# Altium schematic sheet CAN_BUS.SchDoc
size A4; SheetNumber: 1; SheetTotal: 1
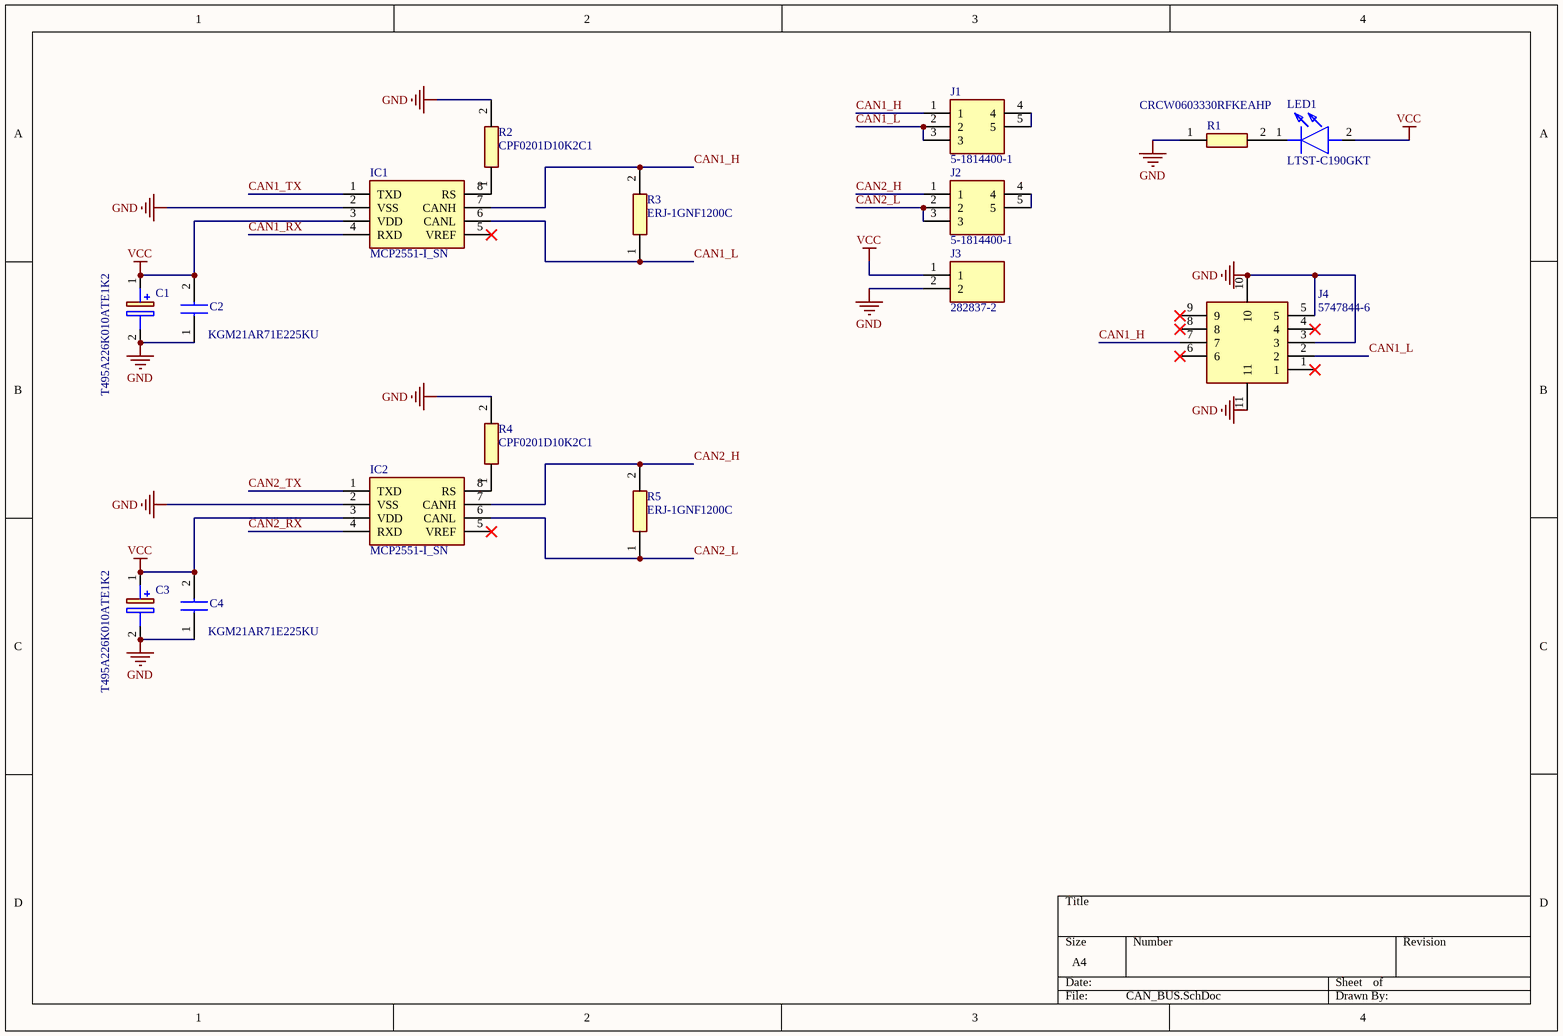
[diagram p0: CAN_BUS.SchDoc]

## Parts
C1  T495A226K010ATE1K2  [T495A]
C2  KGM21AR71E225KU  [CAPC2012X135N]
C3  T495A226K010ATE1K2  [T495A]
C4  KGM21AR71E225KU  [CAPC2012X135N]
IC1  MCP2551-I_SN  [SOIC127P600X175-8N]
IC2  MCP2551-I_SN  [SOIC127P600X175-8N]
J1  5-1814400-1  [518144001]
J2  5-1814400-1  [518144001]
J3  282837-2  [2828372]
J4  5747844-6  [57478446]
LED1  LTST-C190GKT  [LEDC1608X90N]
R1  CRCW0603330RFKEAHP  [CAPC1608X55N]
R2  CPF0201D10K2C1  [RESC0603X28N]
R3  ERJ-1GNF1200C  [ERJ1GN_(0201)]
R4  CPF0201D10K2C1  [RESC0603X28N]
R5  ERJ-1GNF1200C  [ERJ1GN_(0201)]

## Nets
GND: C1.2(-) C2.1 C3.2(-) C4.1 IC1.2(VSS) IC2.2(VSS) J3.2 J4.3 J4.5 J4.10 J4.11 R1.1 R2.2 R4.2
VCC: C1.1(+) C2.2 C3.1(+) C4.2 IC1.3(VDD) IC2.3(VDD) J3.1 LED1.2(A)
CAN1_H: IC1.7(CANH) J1.1 J4.7 R3.2
CAN1_L: IC1.6(CANL) J1.2 J1.3 J4.2 R3.1
CAN1_RX: IC1.4(RXD)
CAN1_TX: IC1.1(TXD)
CAN2_H: IC2.7(CANH) J2.1 R5.2
CAN2_L: IC2.6(CANL) J2.2 J2.3 R5.1
CAN2_RX: IC2.4(RXD)
CAN2_TX: IC2.1(TXD)
NetIC1_8: IC1.8(RS) R2.1
NetIC2_8: IC2.8(RS) R4.1
NetJ1_4: J1.4 J1.5
NetJ2_4: J2.4 J2.5
NetLED1_1: LED1.1(K) R1.2

Not connected (* = marked no-connect by the designer): IC1 5(VREF)*; IC2 5(VREF)*; J4 1* 4* 6* 8* 9*

## Library data of the parts
C1 C3 = T495A226K010ATE1K2: Capacitor Polarised; Manufacturer_Name: KEMET; Datasheet Link: https://content.kemet.com/datasheets/KEM_T2009_T495.pdf; Height: 1.8mm; Manufacturer_Part_Number: T495A226K010ATE1K2; Mouser Part Number: 80-T495A226K10ATE1K2; Mouser Price/Stock: https://www.mouser.co.uk/ProductDetail/KEMET/T495A226K010ATE1K2?qs=sSYV1F9c5cELTAm7MEUyXw%3D%3D
C2 C4 = KGM21AR71E225KU: Capacitor; Manufacturer_Name: KYOCERA; Datasheet Link: https://pt.mouser.com/ProductDetail/KYOCERA-AVX/KGM21AR71E225KU?qs=sGAEpiMZZMt7gvpyg0xT8jBHDtGZvLzXyjuUdgmQe5tN2DBxA0np4w%3D%3D; Height: 1.35mm; Manufacturer_Part_Number: KGM21AR71E225KU; Mouser Part Number: 581-KGM21AR71E225KU; Mouser Price/Stock: https://www.mouser.co.uk/ProductDetail/KYOCERA-AVX/KGM21AR71E225KU?qs=Jm2GQyTW%2FbhCn4KuUMBp1Q%3D%3D
IC1 IC2 = MCP2551-I_SN: Integrated Circuit; Manufacturer_Name: Microchip; Manufacturer_Part_Number: MCP2551-I/SN; Datasheet Link: https://datasheet.datasheetarchive.com/originals/distributors/Datasheets-34/DSA-674994.pdf; Height: 1.75mm; Mouser Part Number: 579-MCP2551-I/SN; Mouser Price/Stock: https://www.mouser.co.uk/ProductDetail/Microchip-Technology/MCP2551-I-SN?qs=9y3LFqDLL8L5zFfqqxdOHg%3D%3D; Arrow Part Number: MCP2551-I/SN; Arrow Price/Stock: https://www.arrow.com/en/products/mcp2551-isn/microchip-technology?region=nac
J1 J2 = 5-1814400-1: Connector; Manufacturer_Name: TE Connectivity; Datasheet Link: https://www.te.com/commerce/DocumentDelivery/DDEController?Action=showdoc&DocId=Customer+Drawing%7F1814400%7FD%7Fpdf%7FEnglish%7FENG_CD_1814400_D_baseFilename.pdf%7F5-1814400-1; Height: 10.43mm; Manufacturer_Part_Number: 5-1814400-1; Mouser Part Number: 571-5-1814400-1; Mouser Price/Stock: https://www.mouser.co.uk/ProductDetail/TE-Connectivity/5-1814400-1?qs=ZMVvPt2N%252B83mDSbcJPKgOA%3D%3D; Arrow Part Number: 5-1814400-1; Arrow Price/Stock: https://www.arrow.com/en/products/5-1814400-1/te-connectivity
J3 = 282837-2: Connector; Manufacturer_Name: TE Connectivity; Datasheet Link: https://www.te.com/commerce/DocumentDelivery/DDEController?Action=srchrtrv&DocNm=282837&DocType=Customer+Drawing&DocLang=English&DocFormat=pdf&PartCntxt=282837-2; Height: 10.3mm; Manufacturer_Part_Number: 282837-2; Mouser Part Number: 571-2828372; Mouser Price/Stock: https://www.mouser.co.uk/ProductDetail/TE-Connectivity/282837-2?qs=A%252Bip%252BNCYi6O2H0NGWOeAxg%3D%3D; Arrow Part Number: 282837-2; Arrow Price/Stock: https://www.arrow.com/en/products/282837-2/te-connectivity?region=europe
J4 = 5747844-6: Connector; Manufacturer_Name: TE Connectivity; Datasheet Link: http://www.te.com/commerce/DocumentDelivery/DDEController?Action=showdoc&DocId=Customer+Drawing%7F5747844%7FP%7Fpdf%7FEnglish%7FENG_CD_5747844_P.pdf%7F5747844-6; Height: 12mm; Manufacturer_Part_Number: 5747844-6; Mouser Part Number: 571-5747844-6; Mouser Price/Stock: https://www.mouser.co.uk/ProductDetail/TE-Connectivity/5747844-6?qs=x6EjVpvqMVNBaI3EeeZZVw%3D%3D; Arrow Part Number: 5747844-6; Arrow Price/Stock: https://www.arrow.com/en/products/5747844-6/te-connectivity?region=europe
LED1 = LTST-C190GKT: LED; Manufacturer_Name: Lite-On; Datasheet Link: https://media.digikey.com/pdf/Data%20Sheets/Lite-On%20PDFs/LTST-C190GKT.pdf; Height: 0.9mm; Manufacturer_Part_Number: LTST-C190GKT; Mouser Part Number: 859-LTST-C190GKT; Mouser Price/Stock: https://www.mouser.co.uk/ProductDetail/Lite-On/LTST-C190GKT?qs=drxkyCeiWgbQzclgbojDOg%3D%3D; Arrow Part Number: LTST-C190GKT; Arrow Price/Stock: https://www.arrow.com/en/products/ltst-c190gkt/lite-on-technology?region=nac
R1 = CRCW0603330RFKEAHP: Resistor; Manufacturer_Name: Vishay; Datasheet Link: http://uk.rs-online.com/web/p/products/8206830; Height: 0.55mm; Manufacturer_Part_Number: CRCW0603330RFKEAHP; Mouser Part Number: 71-CRCW0603330RFKEAH; Mouser Price/Stock: https://www.mouser.co.uk/ProductDetail/Vishay-Dale/CRCW0603330RFKEAHP?qs=40TFAHZMFve19Cb4zHLgwA%3D%3D; Arrow Part Number: CRCW0603330RFKEAHP; Arrow Price/Stock: https://www.arrow.com/en/products/crcw0603330rfkeahp/vishay?region=nac
R2 R4 = CPF0201D10K2C1: Resistor; Manufacturer_Name: TE Connectivity; Datasheet Link: http://www.te.com/commerce/DocumentDelivery/DDEController?Action=showdoc&DocId=Data+Sheet%7F1773200-1%7FA%7Fpdf%7FEnglish%7FENG_DS_1773200-1_A.pdf%7F4-2176215-6; Height: 0.28mm; Manufacturer_Part_Number: CPF0201D10K2C1; Mouser Part Number: N/A; Mouser Price/Stock: https://www.mouser.com/Search/Refine.aspx?Keyword=N%2FA
R3 R5 = ERJ-1GNF1200C: Resistor; Manufacturer_Name: Panasonic; Datasheet Link: https://industrial.panasonic.com/cdbs/www-data/pdf/RDA0000/AOA0000C301.pdf; Height: 0.26mm; Manufacturer_Part_Number: ERJ-1GNF1200C; Mouser Part Number: 667-ERJ-1GNF1200C; Mouser Price/Stock: https://www.mouser.co.uk/ProductDetail/Panasonic/ERJ-1GNF1200C?qs=nuXzIS8loXGKevQlMTNn0A%3D%3D